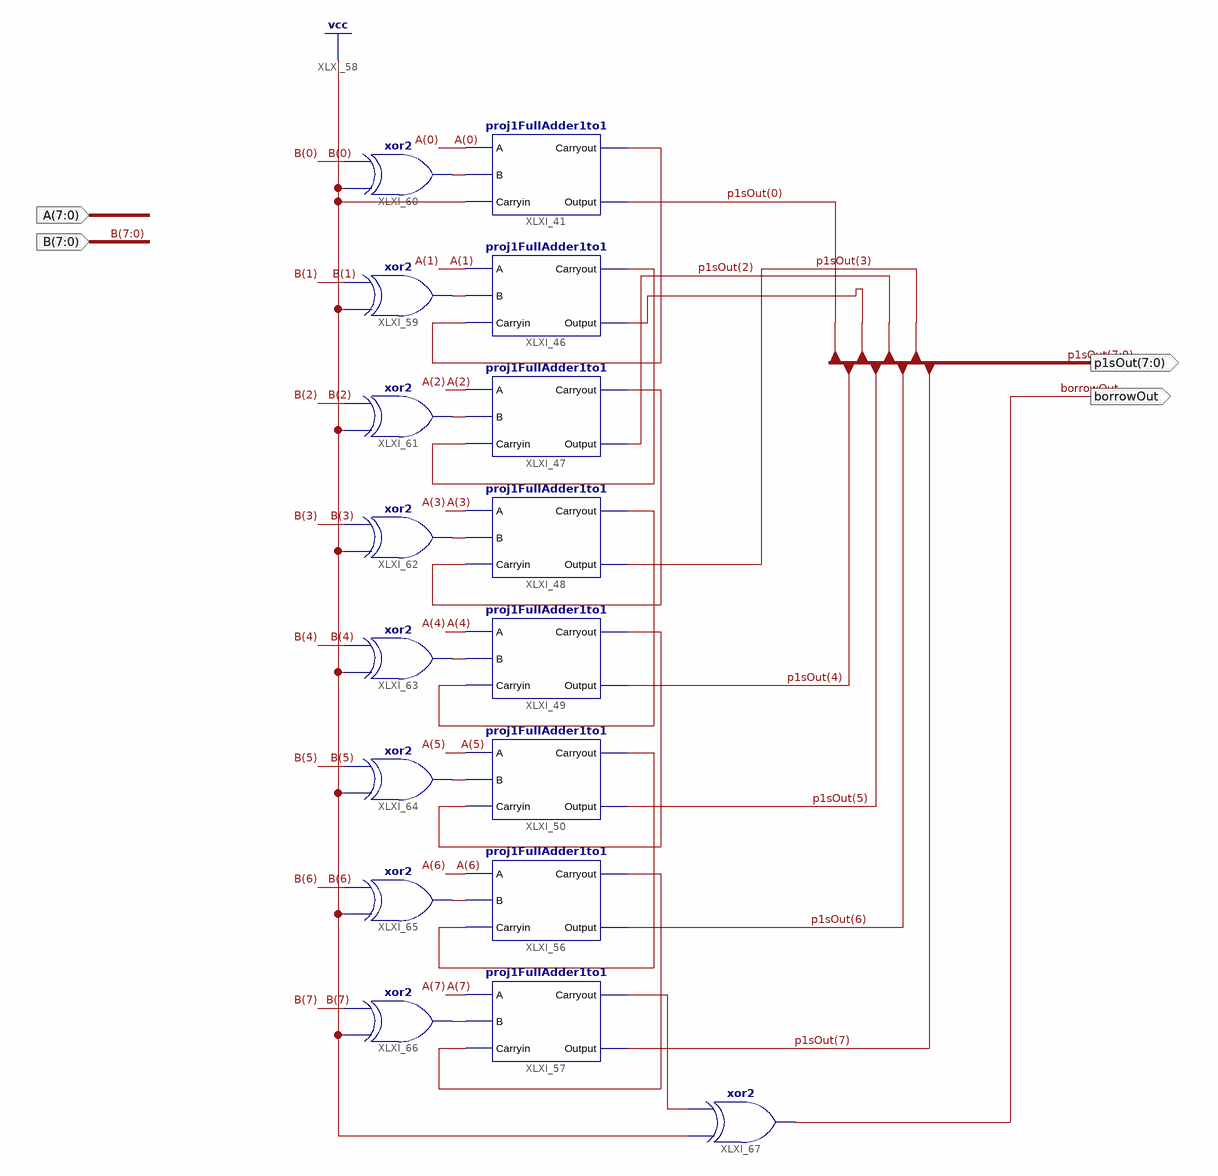
[diagram p0: schematic sheet 1]
// Xilinx ISE schematic proj1Subtractor8to8.sch (spartan6) as structural Verilog: 17 symbols, 4 ports
module proj1Subtractor8to8 (
  input  [7:0] A,
  input  [7:0] B,
  output [7:0] p1sOut,
  output borrowOut
);

  wire XLXN_46, XLXN_47, XLXN_48, XLXN_49, XLXN_50, XLXN_51, XLXN_52, XLXN_53, XLXN_73, XLXN_74, XLXN_75,
       XLXN_76, XLXN_77, XLXN_78, XLXN_79, XLXN_82;

  proj1FullAdder1to1 XLXI_41 (.A(A[0]), .B(XLXN_47), .Carryin(1'b1), .Carryout(XLXN_73), .Output(p1sOut[0]));
  proj1FullAdder1to1 XLXI_46 (.A(A[1]), .B(XLXN_46), .Carryin(XLXN_73), .Carryout(XLXN_74), .Output(p1sOut[1]));
  proj1FullAdder1to1 XLXI_47 (.A(A[2]), .B(XLXN_48), .Carryin(XLXN_74), .Carryout(XLXN_75), .Output(p1sOut[2]));
  proj1FullAdder1to1 XLXI_48 (.A(A[3]), .B(XLXN_49), .Carryin(XLXN_75), .Carryout(XLXN_76), .Output(p1sOut[3]));
  proj1FullAdder1to1 XLXI_49 (.A(A[4]), .B(XLXN_50), .Carryin(XLXN_76), .Carryout(XLXN_77), .Output(p1sOut[4]));
  proj1FullAdder1to1 XLXI_50 (.A(A[5]), .B(XLXN_51), .Carryin(XLXN_77), .Carryout(XLXN_79), .Output(p1sOut[5]));
  proj1FullAdder1to1 XLXI_56 (.A(A[6]), .B(XLXN_52), .Carryin(XLXN_79), .Carryout(XLXN_78), .Output(p1sOut[6]));
  proj1FullAdder1to1 XLXI_57 (.A(A[7]), .B(XLXN_53), .Carryin(XLXN_78), .Carryout(XLXN_82), .Output(p1sOut[7]));
  xor XLXI_59 (XLXN_46, 1'b1, B[1]);
  xor XLXI_60 (XLXN_47, 1'b1, B[0]);
  xor XLXI_61 (XLXN_48, 1'b1, B[2]);
  xor XLXI_62 (XLXN_49, 1'b1, B[3]);
  xor XLXI_63 (XLXN_50, 1'b1, B[4]);
  xor XLXI_64 (XLXN_51, 1'b1, B[5]);
  xor XLXI_65 (XLXN_52, 1'b1, B[6]);
  xor XLXI_66 (XLXN_53, 1'b1, B[7]);
  xor XLXI_67 (borrowOut, 1'b1, XLXN_82);
endmodule
